# EAGLE schematic Aciduino_Schematic_v6 (EAGLE 9.7.0)
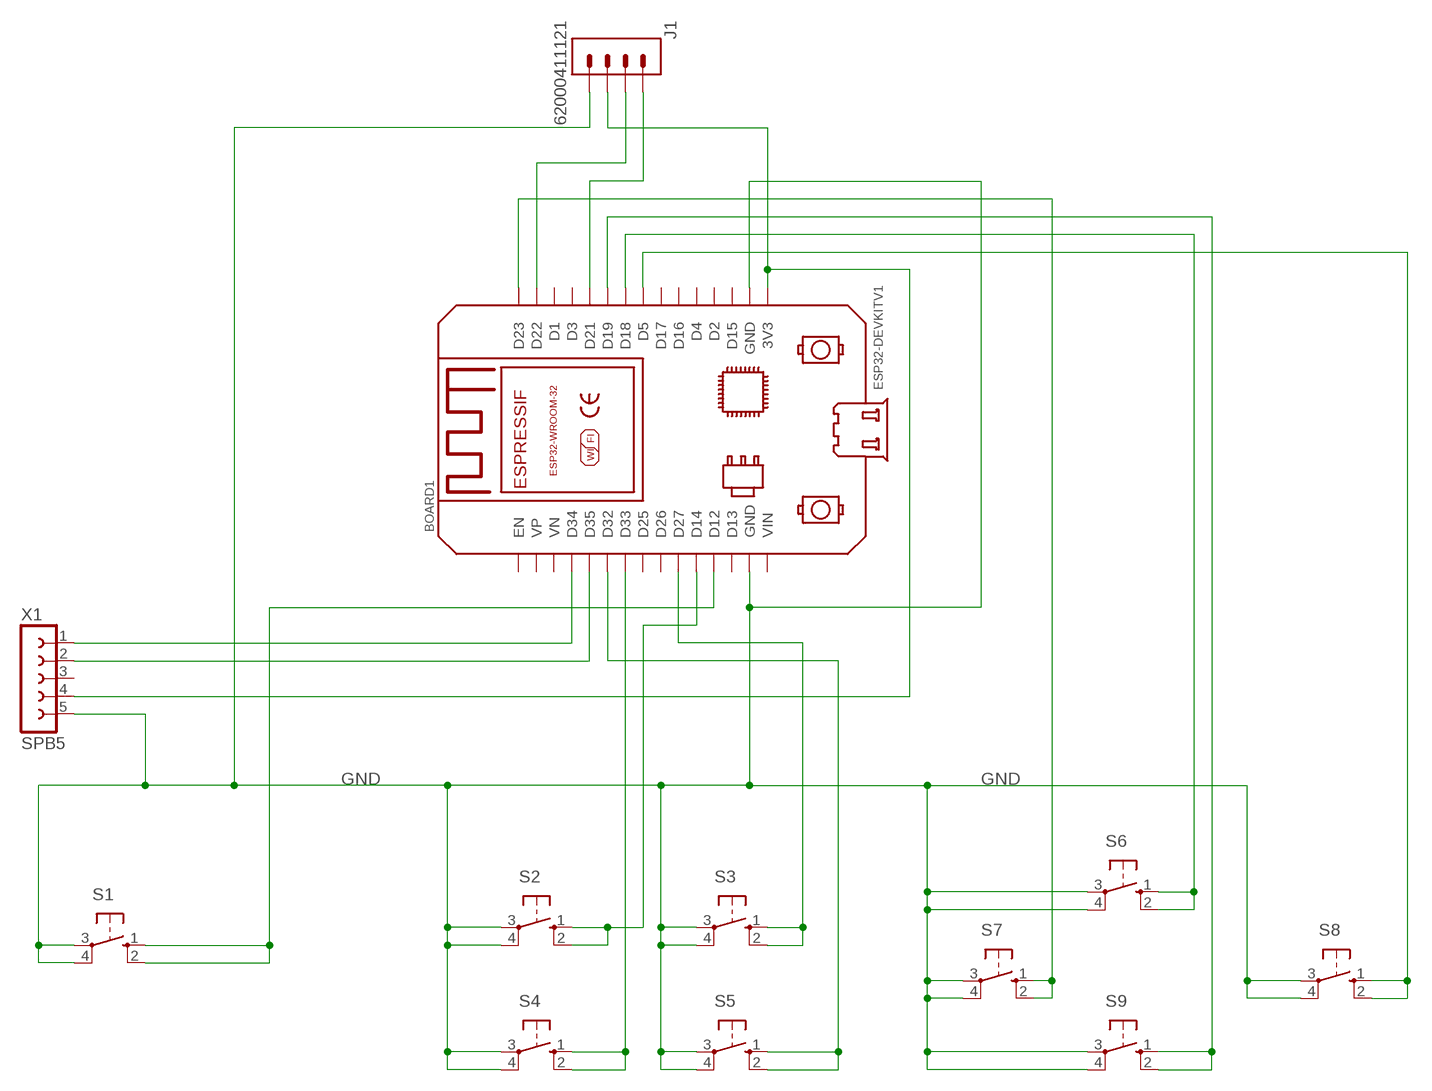
[diagram p0: schematic, sheet 1]

## Parts
BOARD1  ESP32DEVKITV1SHRIDATTDUDHAT  [ESP32-DEVKITV1]
J1  62000411121  [62000411121]
S1  10-XX  [B3F-10XX]
S2  10-XX  [B3F-10XX]
S3  10-XX  [B3F-10XX]
S4  10-XX  [B3F-10XX]
S5  10-XX  [B3F-10XX]
S6  10-XX  [B3F-10XX]
S7  10-XX  [B3F-10XX]
S8  10-XX  [B3F-10XX]
S9  10-XX  [B3F-10XX]
X1  SPB5  [SPB5]

## Nets
GND [GND]: BOARD1.GND BOARD1.GND@1(GND) J1.4 S1.3(P) S1.4(P1) S2.3(P) S2.4(P1) S3.3(P) S3.4(P1) S4.3(P) S4.4(P1) S5.3(P) S5.4(P1) S6.3(P) S6.4(P1) S7.3(P) S7.4(P1) S8.3(P) S8.4(P1) S9.3(P) S9.4(P1) X1.5
N$1: BOARD1.D12 S1.1(S) S1.2(S1)
N$2: BOARD1.D14 S2.1(S) S2.2(S1)
N$3: BOARD1.D21 J1.1
N$4: BOARD1.D27 S3.1(S) S3.2(S1)
N$5: BOARD1.D33 S4.1(S) S4.2(S1)
N$6: BOARD1.D32 S5.1(S) S5.2(S1)
N$7: BOARD1.D5 S8.1(S) S8.2(S1)
N$8: BOARD1.D18 S6.1(S) S6.2(S1)
N$9: BOARD1.D19 S9.1(S) S9.2(S1)
N$10: BOARD1.D23 S7.1(S) S7.2(S1)
N$11: BOARD1.3V3 J1.3 X1.4
N$12: BOARD1.D34 X1.1
N$13: BOARD1.D35 X1.2
N$14: BOARD1.D22 J1.2
Unconnected: BOARD1.D1 BOARD1.D2 BOARD1.D3 BOARD1.D4 BOARD1.D13 BOARD1.D15 BOARD1.D16 BOARD1.D17 BOARD1.D25 BOARD1.D26 BOARD1.EN BOARD1.VIN BOARD1.VN BOARD1.VP X1.3

## Library data of the parts
BOARD1 = ESP32-DEVKITV1:ESP32DEVKITV1: https://github.com/shridattdudhat
J1 = Headers:62000411121: THT Vertical Pin Header WR-PHD, Pitch 2.00 mm, Single Row, 4 pins Manufacturer's datasheet <https://datasheet.octopart.com/62000411121-W%C3%BCrth-Elektronik-datasheet-117282003.pdf>; CREATED_BY: PCBLayout.com; MANUFACTURER: Würth Elektronik; MPN: 62000411121
S1-S9 = PulseOximeterECG_AU:10-XX: OMRON SWITCH; MPN: B3F-1000; OC_FARNELL: 176432; OC_NEWARK: 36M3542
X1 = con-hirschmann:SPB5: CONNECTOR 5 pins; OC_FARNELL: unknown; OC_NEWARK: unknown